# Altium schematic sheet TPS60403.SchDoc
size A4
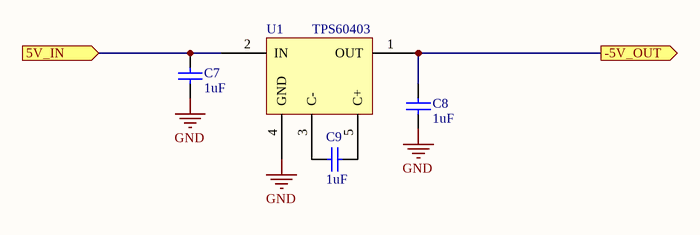
[diagram p0: TPS60403.SchDoc]

## Parts
C7  value 1uF  [CAP_0603]
C8  value 1uF  [CAP_0603]
C9  value 1uF  [CAP_0603]
U1  TPS60403  [SOT23-5]

## Ports
5V_IN (in), -5V_OUT (out)

## Nets
GND: C7.2 C8.2 U1.4(GND)
5V_IN: C7.1 U1.2(IN) ; port 5V_IN
-5V_OUT: C8.1 U1.1(OUT) ; port -5V_OUT
NetC9_1: C9.1 U1.5(C+)
NetC9_2: C9.2 U1.3(C-)

## Library data of the parts
C7-C9 = Cap Semi: Capacitor (Semiconductor SIM Model); Published: 8-Jun-2000; LatestRevisionDate: 17-Jul-2002; LatestRevisionNote: Re-released for DXP Platform.; PackageReference: C1206; Publisher: Altium Limited
U1 = Component_1